# EAGLE design tire_temp (EAGLE 6.1)
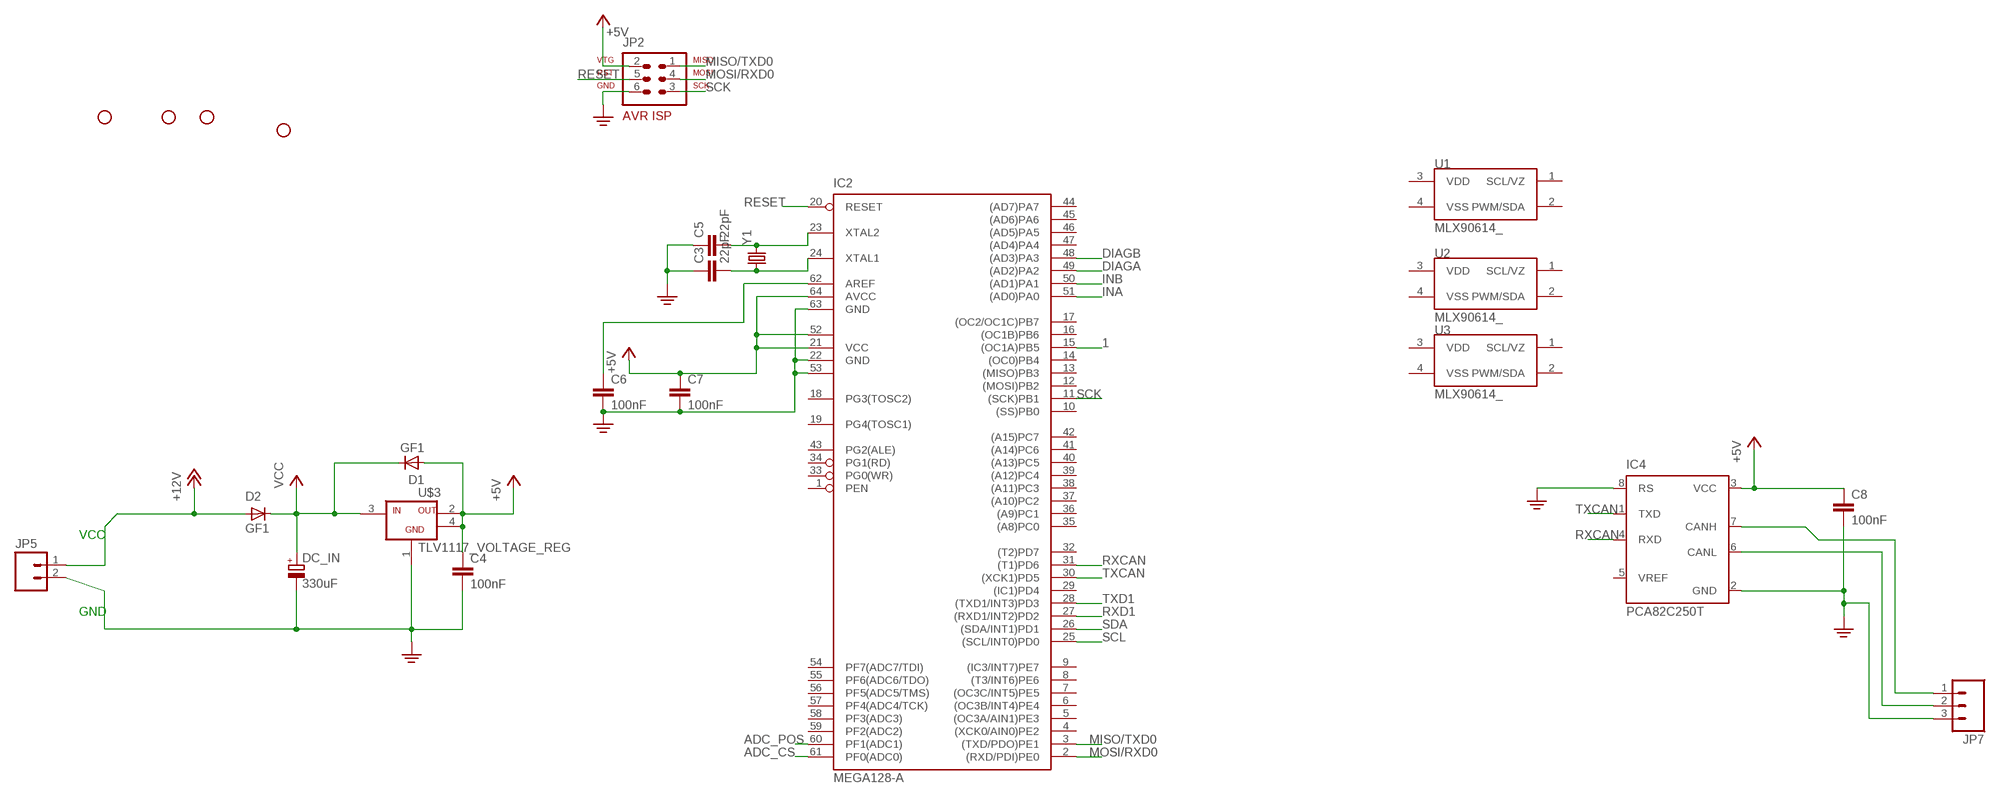
[diagram p0: schematic, sheet 1]

## Parts
C3  22pF  C-EUC0603K  [C0603K]
C4  100nF  C-EUC0603K  [C0603K]
C5  22pF  C-EUC0603K  [C0603K]
C6  100nF  C-EUC0603K  [C0603K]
C7  100nF  C-EUC0603K  [C0603K]
C8  100nF  C-EUC0603K  [C0603K]
D1  GF1  [SMA-DO214AC]
D2  GF1  [SMA-DO214AC]
DC_IN  330uF  CPOL-EUE15-5AXIAL  [E15-5]
IC2  MEGA128-A  [TQFP64]
IC4  PCA82C250T  [SO8]
JP1  STAND-OFF  [STAND-OFF]
JP2  AVR-ISP-6  [AVR-ISP-6]
JP3  STAND-OFF  [STAND-OFF]
JP4  STAND-OFF  [STAND-OFF]
JP5  M02-JST-2MM-SMT  [JST-2-SMD]
JP6  STAND-OFF  [STAND-OFF]
JP7  M03  [JST-3-SMD]
U1  MLX90614_  [TO-39]
U2  MLX90614_  [TO-39]
U3  MLX90614_  [TO-39]
U$3  TLV1117_VOLTAGE_REG  [SOT-232]
Y1  CRYSTAL5X3  [CRYSTAL-SMD-5X3]

## Nets
1: IC2.15((OC1A)PB5)
+5V: C4.1 C7.1 C8.1 D1.A IC2.21(VCC) IC2.52(VCC1) IC2.64(AVCC) IC4.3(VCC) JP2.2 U$3.2(VOUT) U$3.4(OUT2)
+12V: D2.A JP5.1
ADC_CS: IC2.61(PF0(ADC0))
ADC_POS: IC2.60(PF1(ADC1))
CANJUMP1: IC4.7(CANH) JP7.1
DIAGA: IC2.49((AD2)PA2)
DIAGB: IC2.48((AD3)PA3)
INA: IC2.51((AD0)PA0)
INB: IC2.50((AD1)PA1)
MISO/TXD0: IC2.3((TXD/PDO)PE1) JP2.1
MOSI/RXD0: IC2.2((RXD/PDI)PE0) JP2.4
N$1: C3.2 IC2.24(XTAL1) Y1.1
N$2: C5.2 IC2.23(XTAL2) Y1.3
N$10: C6.1 IC2.62(AREF)
N$51: IC4.6(CANL) JP7.2
PE: C3.1 C4.2 C5.1 C6.2 C7.2 C8.2 DC_IN.- IC2.22(GND) IC2.53(GND1) IC2.63(GND) IC4.2(GND) IC4.8(RS) JP2.6 JP5.2 JP7.3 U$3.1(GND)
RESET: IC2.20(RESET) JP2.5
RXCAN: IC2.31((T1)PD6) IC4.4(RXD)
RXD1: IC2.27((RXD1/INT2)PD2)
SCK: IC2.11((SCK)PB1) JP2.3
SCL: IC2.25((SCL/INT0)PD0)
SDA: IC2.26((SDA/INT1)PD1)
TXCAN: IC2.30((XCK1)PD5) IC4.1(TXD)
TXD1: IC2.28((TXD1/INT3)PD3)
VCC: D1.K(C) D2.K(C) DC_IN.+ U$3.3(VIN)
Unconnected: IC2.1(PEN) IC2.4((XCK0/AIN0)PE2) IC2.5((OC3A/AIN1)PE3) IC2.6((OC3B/INT4)PE4) IC2.7((OC3C/INT5)PE5) IC2.8((T3/INT6)PE6) IC2.9((IC3/INT7)PE7) IC2.10((SS)PB0) IC2.12((MOSI)PB2) IC2.13((MISO)PB3) IC2.14((OC0)PB4) IC2.16((OC1B)PB6) IC2.17((OC2/OC1C)PB7) IC2.18(PG3(TOSC2)) IC2.19(PG4(TOSC1)) IC2.29((IC1)PD4) IC2.32((T2)PD7) IC2.33(PG0(WR)) IC2.34(PG1(RD)) IC2.35((A8)PC0) IC2.36((A9)PC1) IC2.37((A10)PC2) IC2.38((A11)PC3) IC2.39((A12)PC4) IC2.40((A13)PC5) IC2.41((A14)PC6) IC2.42((A15)PC7) IC2.43(PG2(ALE)) IC2.44((AD7)PA7) IC2.45((AD6)PA6) IC2.46((AD5)PA5) IC2.47((AD4)PA4) IC2.54(PF7(ADC7/TDI)) IC2.55(PF6(ADC6/TDO)) IC2.56(PF5(ADC5/TMS)) IC2.57(PF4(ADC4/TCK)) IC2.58(PF3(ADC3)) IC2.59(PF2(ADC2)) IC4.5(VREF) U1.1(SCL/VZ) U1.2(PWM/SDA) U1.3(VDD) U1.4(VSS) U2.1(SCL/VZ) U2.2(PWM/SDA) U2.3(VDD) U2.4(VSS) U3.1(SCL/VZ) U3.2(PWM/SDA) U3.3(VDD) U3.4(VSS)

## Notes on the sheet
- VCC
- GND

## Library data of the parts
C3-C8 = rcl:C-EU: CAPACITOR, European symbol
D1 D2 = diode:GF1: DIODE
DC_IN = rcl:CPOL-EU: POLARIZED CAPACITOR, European symbol
IC2 = atmel:MEGA128: MICROCONTROLLER 128 Kbytes FLASH 4 Kbytes SRAM 4 Kbytes EEPROM DUAL USART 8-channel 10 bit ADC Source: avr.lbr
IC4 = micro-philips:PCA82C250: CAN CONTROLLER INTERFACE
JP1 JP3 JP4 JP6 = SparkFun:STAND-OFF: Stand Off This is the mechanical footprint for a #4 phillips button head screw. Use the keepout ring to avoid running the screw head into surrounding components. SKU : PRT-00447
JP2 = avr-5:AVR-ISP-6: AVR ISP-6 Serial Programming Header
JP5 = SparkFun-Connectors:M02: Header 2 Standard 2-pin 0.1" header. Use with straight break away headers (SKU : PRT-00116), right angle break away headers (PRT-00553), swiss pins (PRT-00743), machine pins (PRT-00117), and female headers (PRT-00115). Molex polarized connector foot print use with SKU : PRT-08233 with associated crimp pins and housings.
JP7 = SparkFun-Connectors:M03: Header 3 Standard 3-pin 0.1" header. Use with straight break away headers (SKU : PRT-00116), right angle break away headers (PRT-00553), swiss pins (PRT-00743), machine pins (PRT-00117), and female headers (PRT-00115). Molex polarized connector foot print use with SKU : PRT-08232 with associated crimp pins and housings.
U1-U3 = SparkFun-Sensors:MLX90614: Non-contact PIR I2C interface temperature sensor
U$3 = unicorn_v2:TLV1117_VOLTAGE_REG
Y1 = SparkFun-FreqCtrl:CRYSTAL: Various standard crystals. Proven footprints. Spark Fun Electronics SKU : COM-00534

## Board
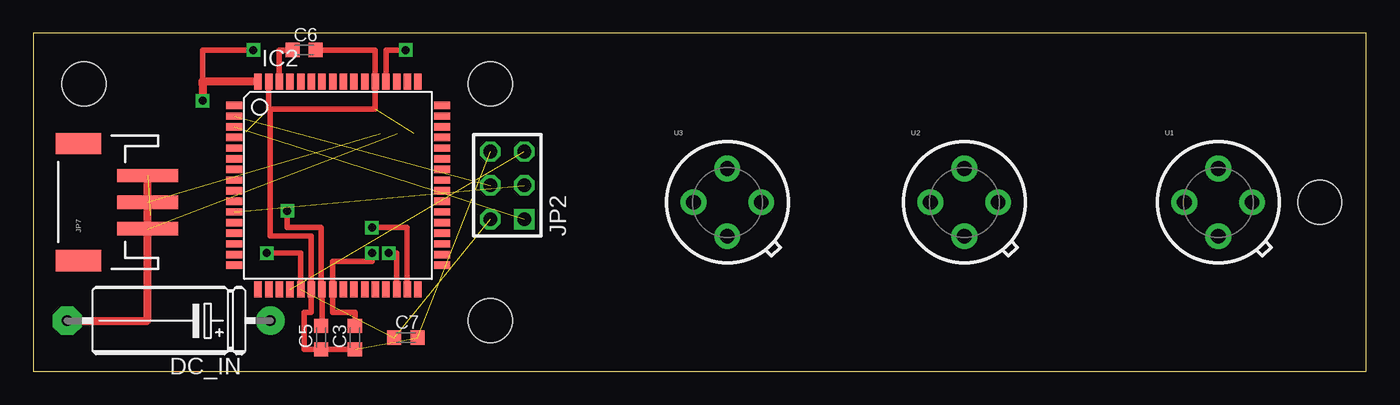
[diagram p1: board, top side]
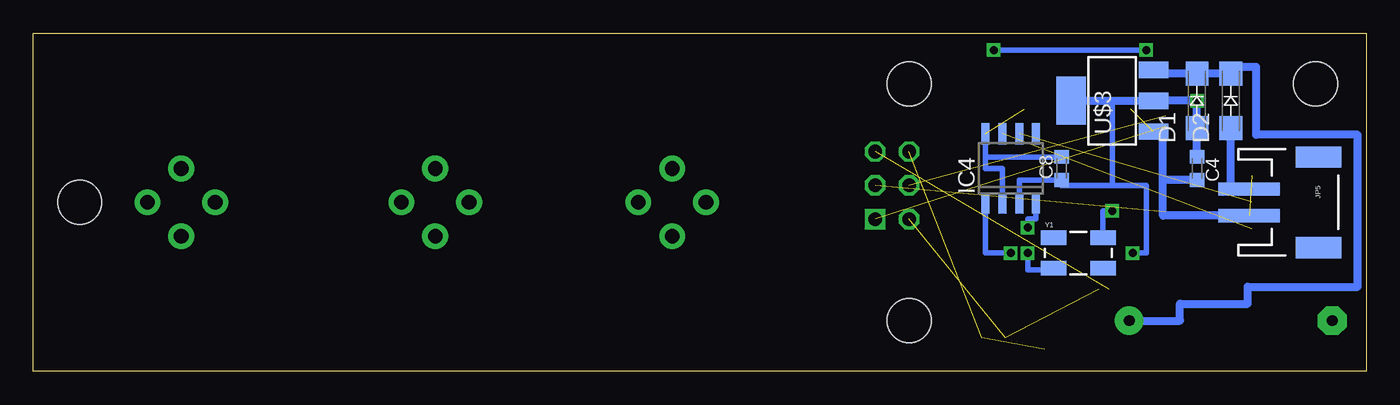
[diagram p2: board, bottom side, seen from below]

Size 100 x 25.39 mm. Coordinates in mm from the lower left corner, seen from the top.
Outline: 0,0 100,0 100,25.39 0,25.39 0,0
Copper layers (1*16): Top 0.035mm / dielectric 1.5mm / Bottom 0.035mm
Design rules: minimum track width 10mil, minimum drill 24mil, track to track 8mil, track to pad 8mil, pad to pad 8mil, via to via 8mil, smd to smd 8mil, copper to edge 40mil, drill to drill 8mil, minimum pad ring 10mil, minimum via ring 8mil, stop-mask expansion 4mil, vias tented up to drill 0mil, thermal gap 10mil

### Footprints (pad centres in the part's own frame; a part is rotated, then mirrored left to right if it is on the bottom)
C0603K = smd 1.05 x 1.08: 1 -0.875,0; 2 0.875,0
SMA-DO214AC = smd 1.8 x 1.7: A -2.05,0; K 2.05,0
E15-5 = drill 0.813 pad 2.159: + -7.62,0 | drill 0.813 pad 2.159 octagon: - 7.62,0
TQFP64 = smd 1.194 x 0.559: 1 -7.8,6; 2 -7.8,5.2; 3 -7.8,4.4; 4 -7.8,3.6; 5 -7.8,2.8; 6 -7.8,2; 7 -7.8,1.2; 8 -7.8,0.4; 9 -7.8,-0.4; 10 -7.8,-1.2; 11 -7.8,-2; 12 -7.8,-2.8; 13 -7.8,-3.6; 14 -7.8,-4.4; 15 -7.8,-5.2; 16 -7.8,-6; 33 7.8,-6; 34 7.8,-5.2; 35 7.8,-4.4; 36 7.8,-3.6; 37 7.8,-2.8; 38 7.8,-2; 39 7.8,-1.2; 40 7.8,-0.4; 41 7.8,0.4; 42 7.8,1.2; 43 7.8,2; 44 7.8,2.8; 45 7.8,3.6; 46 7.8,4.4; 47 7.8,5.2; 48 7.8,6 | smd 0.559 x 1.194: 17 -6,-7.8; 18 -5.2,-7.8; 19 -4.4,-7.8; 20 -3.6,-7.8; 21 -2.8,-7.8; 22 -2,-7.8; 23 -1.2,-7.8; 24 -0.4,-7.8; 25 0.4,-7.8; 26 1.2,-7.8; 27 2,-7.8; 28 2.8,-7.8; 29 3.6,-7.8; 30 4.4,-7.8; 31 5.2,-7.8; 32 6,-7.8; 49 6,7.8; 50 5.2,7.8; 51 4.4,7.8; 52 3.6,7.8; 53 2.8,7.8; 54 2,7.8; 55 1.2,7.8; 56 0.4,7.8; 57 -0.4,7.8; 58 -1.2,7.8; 59 -2,7.8; 60 -2.8,7.8; 61 -3.6,7.8; 62 -4.4,7.8; 63 -5.2,7.8; 64 -6,7.8
SO8 = smd 0.6 x 1.6: 1 -1.905,-2.6; 2 -0.635,-2.6; 3 0.635,-2.6; 4 1.905,-2.6; 5 1.905,2.6; 6 0.635,2.6; 7 -0.635,2.6; 8 -1.905,2.6
STAND-OFF = hole 3.302: 0,0
AVR-ISP-6 = drill 1.016 square: 1 -2.54,-1.27 | drill 1.016 octagon: 2 -2.54,1.27; 3 0,-1.27; 4 0,1.27; 5 2.54,-1.27; 6 2.54,1.27
JST-2-SMD = smd 1 x 4.6: 1 -1,-3.7; 2 1,-3.7 | smd 1.6 x 3.4: NC1 -3.4,1.5; NC2 3.4,1.5
JST-3-SMD = smd 1 x 4.6: 1 -1.99,-4.77; 2 0.01,-4.77; 3 2.01,-4.77 | smd 1.6 x 3.4: NC1 -4.39,0.43; NC2 4.41,0.43
TO-39 = drill 1.1 pad 1.93: 1 2.54,0; 2 0,2.54; 3 -2.54,0; 4 0,-2.54
SOT-232 = smd 1.219 x 2.235: 1 -2.311,-3.099; 2 0,-3.099; 3 2.311,-3.099 | smd 3.6 x 2.2: 4 0,3.099
CRYSTAL-SMD-5X3 = smd 1.9 x 1.1: 1 -1.85,-1.15; 2 1.85,-1.15; 3 1.85,1.15; 4 -1.85,1.15

### Placement (x,y rotation side)
C3  24.13,2.54 90 top
C4  12.7,15.24 270 bottom
C5  21.59,2.54 90 top
C6  20.32,24.13 0 top
C7  27.94,2.54 0 top
C8  22.86,15.24 90 bottom
D1  12.7,20.32 90 bottom
D2  10.16,20.32 90 bottom
DC_IN  10.16,3.81 180 top
IC2  22.86,13.97 0 top
IC4  26.67,15.24 0 bottom
JP1  34.29,3.81 0 top
JP2  35.56,13.97 90 top
JP3  96.52,12.7 0 top
JP4  34.29,21.59 0 top
JP5  5.08,12.7 270 bottom
JP6  3.81,21.59 0 top
JP7  3.81,12.7 90 top
U1  88.9,12.7 0 top
U2  69.85,12.7 0 top
U3  52.07,12.7 0 top
U$3  19.05,20.32 90 bottom
Y1  21.59,8.89 0 bottom

### Tracks (layer width: path | path; a pad name or v marks a point on that pad's centre or on a via)
+5V  (via drill 0.6)  (2 unrouted)
  Top 0.406: v27.94,24.13 26.46,24.13 IC2.52 | v16.51,24.13 12.7,24.13 12.7,21.59 | v17.52,8.89 20.06,8.89 IC2.21
  Top 0.61: IC2.64 12.7,21.77 12.7,21.59 v12.7,20.32
  Bottom 0.406: v27.94,24.13 v16.51,24.13 | IC4.3 26.04,14.37 C8.1 22.86,13.97 19.05,13.97 | U$3.4 19.05,20.32 19.05,13.97 | v17.52,8.89 16.51,8.89 16.51,13.97 19.05,13.97
  Bottom 0.61: C4.1 D1.A v12.7,20.32 U$3.2 U$3.4
+12V
  Bottom 0.61: JP5.1 10.16,13.7 D2.A
CANJUMP1  (1 unrouted)
MISO/TXD0  (1 unrouted)
MOSI/RXD0  (1 unrouted)
N$1  (via drill 0.6)
  Top 0.406: v25.4,8.89 25.4,8.26 22.46,8.26 IC2.24 22.46,4.45 24.13,4.45 C3.2
  Bottom 0.406: v25.4,8.89 25.4,7.62 24.13,7.62 24.13,7.74 Y1.1
N$2  (via drill 0.6)
  Top 0.406: v19.05,12.06 19.05,10.79 21.59,10.79 21.59,6.17 IC2.23 21.66,3.41 C5.2
  Bottom 0.406: v19.05,12.06 19.74,12.06 Y1.3
N$10
  Top 0.406: C6.1 18.46,24.13 IC2.62
N$51  (1 unrouted)
PE  (5 unrouted)
  Top 0.406: 17.78,19.69 25.66,19.69 IC2.53 25.66,24.13 C6.2 | IC2.63 17.66,19.69 17.78,19.69 | 17.78,19.69 17.78,10.16 20.86,10.16 IC2.22 20.86,4.45 20.32,4.45 20.32,1.67 C5.1 C3.1
  Top 0.61: DC_IN.- 8.58,3.81 JP7.3
  Bottom 0.406: IC4.2 27.3,15.24 28.57,15.24 IC4.8 28.57,16.12 C8.2
  Bottom 0.61: U$3.1 15.24,18.01 15.24,14.37 | JP5.2 15.24,11.7 15.24,14.37 | C4.2 15.24,14.37
RESET  (1 unrouted)
RXCAN  (via drill 0.6)
  Top 0.406: v25.4,10.79 28.06,10.79 IC2.31
  Bottom 0.406: IC4.4 24.77,11.43 25.4,11.43 v25.4,10.79
SCK  (1 unrouted)
TXCAN  (via drill 0.6)
  Top 0.406: v26.67,8.89 27.26,8.89 IC2.30
  Bottom 0.406: v26.67,8.89 28.57,8.89 IC4.1
VCC
  Bottom 0.61: D1.K D2.K 10.16,22.86 8.26,22.86 8.26,17.78 0.64,17.78 0.64,6.35 8.89,6.35 8.89,5.08 13.97,5.08 13.97,3.81 DC_IN.+ | D1.K 12.7,22.86 | U$3.3 16.51,22.63 | 16.51,22.63 16.51,22.86 | D1.K 16.51,22.37 16.51,22.63